# EAGLE schematic InkTime (EAGLE 9.7.0)

## Sheet 1 of 2
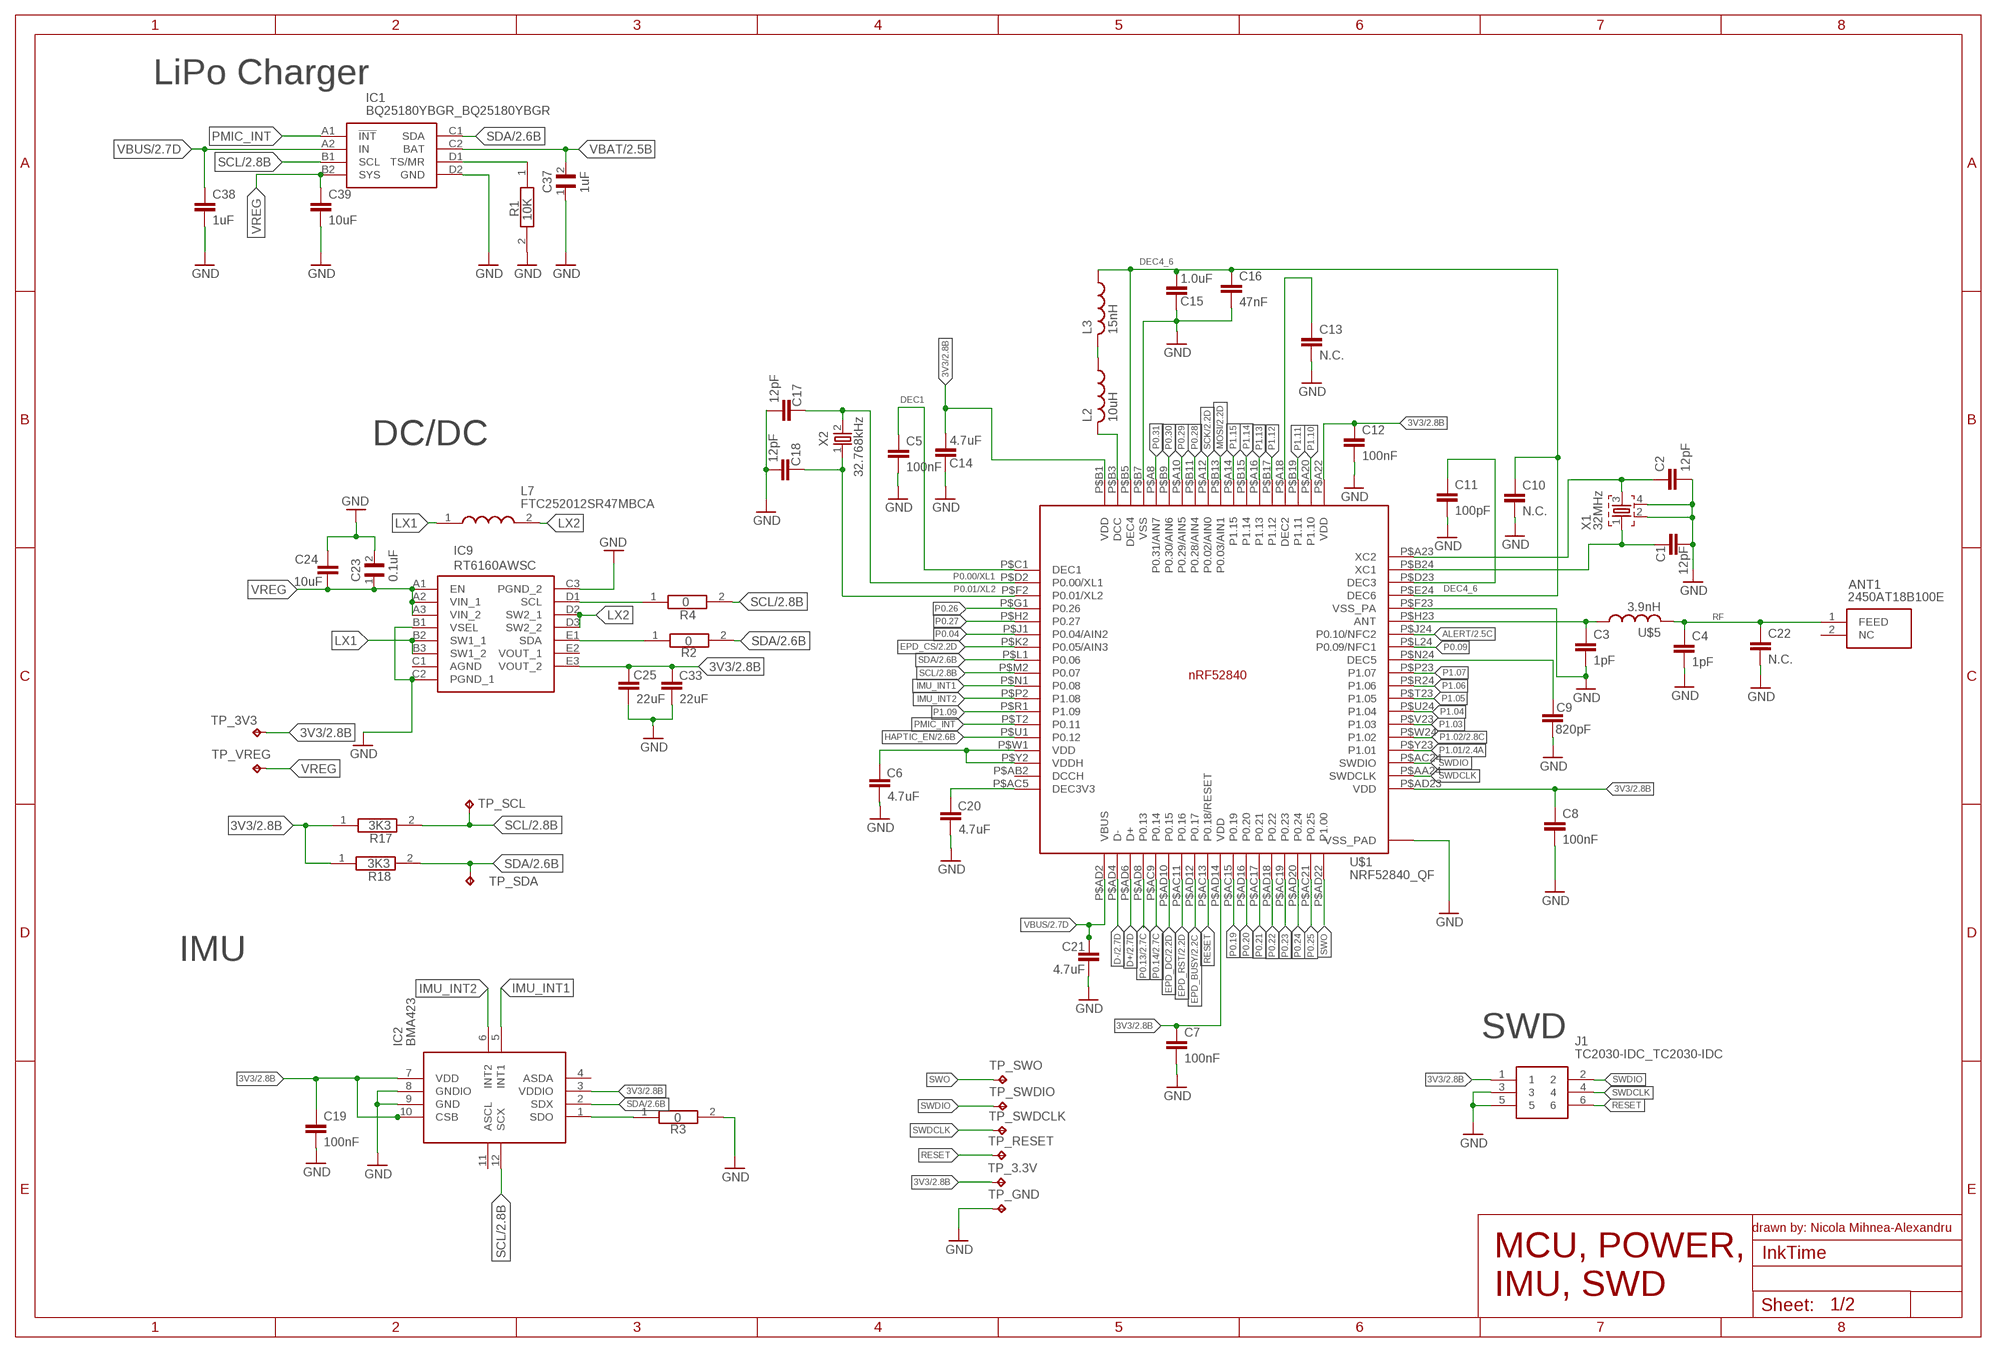
[diagram p0: schematic, sheet 1]

### Parts
ANT1  2450AT18B100E  2450AT18B100E_2450AT18B100E  [2450AT18B100E_ANTC3216X140N]
C1  12pF  NORDIC_NRF_3_CAPACITOR_0201_N  [NORDIC_NRF_3_RESC0201_N]
C2  12pF  NORDIC_NRF_3_CAPACITOR_0201_N  [NORDIC_NRF_3_RESC0201_N]
C3  1pF  NORDIC_NRF_3_CAPACITOR_0201_N  [NORDIC_NRF_3_RESC0201_N]
C4  1pF  NORDIC_NRF_3_CAPACITOR_0201_N  [NORDIC_NRF_3_RESC0201_N]
C5  100nF  NORDIC_NRF_3_CAPACITOR_0201_N  [NORDIC_NRF_3_RESC0201_N]
C6  4.7uF  NORDIC_NRF_3_CAPACITOR_0402_N  [NORDIC_NRF_3_RESC0402_N]
C7  100nF  NORDIC_NRF_3_CAPACITOR_0201_N  [NORDIC_NRF_3_RESC0201_N]
C8  100nF  NORDIC_NRF_3_CAPACITOR_0201_N  [NORDIC_NRF_3_RESC0201_N]
C9  820pF  NORDIC_NRF_3_CAPACITOR_0201_N  [NORDIC_NRF_3_RESC0201_N]
C10  N.C.  NORDIC_NRF_3_CAPACITOR_0201_N  [NORDIC_NRF_3_RESC0201_N]
C11  100pF  NORDIC_NRF_3_CAPACITOR_0201_N  [NORDIC_NRF_3_RESC0201_N]
C12  100nF  NORDIC_NRF_3_CAPACITOR_0201_N  [NORDIC_NRF_3_RESC0201_N]
C13  N.C.  NORDIC_NRF_3_CAPACITOR_0201_N  [NORDIC_NRF_3_RESC0201_N]
C14  4.7uF  NORDIC_NRF_3_CAPACITOR_0402_N  [NORDIC_NRF_3_RESC0402_N]
C15  1.0uF  NORDIC_NRF_3_CAPACITOR_0402_N  [NORDIC_NRF_3_RESC0402_N]
C16  47nF  NORDIC_NRF_3_CAPACITOR_0201_N  [NORDIC_NRF_3_RESC0201_N]
C17  12pF  NORDIC_NRF_3_CAPACITOR_0201_N  [NORDIC_NRF_3_RESC0201_N]
C18  12pF  NORDIC_NRF_3_CAPACITOR_0201_N  [NORDIC_NRF_3_RESC0201_N]
C19  100nF  NORDIC_NRF_3_CAPACITOR_0201_N  [NORDIC_NRF_3_RESC0201_N]
C20  4.7uF  NORDIC_NRF_3_CAPACITOR_0402_N  [NORDIC_NRF_3_RESC0402_N]
C21  4.7uF  NORDIC_NRF_3_CAPACITOR_0402_N  [NORDIC_NRF_3_RESC0402_N]
C22  N.C.  NORDIC_NRF_3_CAPACITOR_0201_N  [NORDIC_NRF_3_RESC0201_N]
C23  0.1uF  GRM011R60J152KE01L_2_GRM011R60J152KE01LGRM  [GRM011R60J152KE01L_2_CAPC0201X13N]
C24  10uF  NORDIC_NRF_3_CAPACITOR_0402_N  [NORDIC_NRF_3_RESC0402_N]
C25  22uF  NORDIC_NRF_3_CAPACITOR_0402_N  [NORDIC_NRF_3_RESC0402_N]
C33  22uF  NORDIC_NRF_3_CAPACITOR_0402_N  [NORDIC_NRF_3_RESC0402_N]
C37  1uF  GRM011R60J152KE01L_2_GRM011R60J152KE01LGRM  [GRM011R60J152KE01L_2_CAPC0201X13N]
C38  1uF  NORDIC_NRF_3_CAPACITOR_0402_N  [NORDIC_NRF_3_RESC0402_N]
C39  10uF  NORDIC_NRF_3_CAPACITOR_0402_N  [NORDIC_NRF_3_RESC0402_N]
IC1  BQ25180YBGR_BQ25180YBGR  [BQ25180YBGR_BGA8C40P2X4_100X155X50]
IC2  BMA423  BMA423_BMA423  [BMA423_BMA423]
IC9  RT6160AWSC  RT6160AWSC_RT6160AWSC  [RT6160AWSC_BGA15C40P3X5_140X230X60]
J1  TC2030-IDC_TC2030-IDC  [TC2030-IDC_TC2030IDC]
L2  10uH  NORDIC_NRF_2_INDUCTOR_0201_N  [NORDIC_NRF_2_RESC0201_N]
L3  15nH  NORDIC_NRF_2_INDUCTOR_0201_N  [NORDIC_NRF_2_RESC0201_N]
L7  FTC252012SR47MBCA  MLP2016SR47MT0S1_FTC252012SR47MBCA  [MLP2016SR47MT0S1_INDC2016X100N]
R1  10K  CPF0201D7K68C1_CPF0201D7K68C1  [CPF0201D7K68C1_0201]
R2  0  CPF0201D7K68C1_CPF0201D7K68C1  [CPF0201D7K68C1_0201]
R3  0  CPF0201D7K68C1_CPF0201D7K68C1  [CPF0201D7K68C1_0201]
R4  0  CPF0201D7K68C1_CPF0201D7K68C1  [CPF0201D7K68C1_0201]
R17  3K3  CPF0201D7K68C1_CPF0201D7K68C1  [CPF0201D7K68C1_0201]
R18  3K3  CPF0201D7K68C1_CPF0201D7K68C1  [CPF0201D7K68C1_0201]
TP_3.3V  HECTOR_WATCH_1_TPTP20R  [HECTOR_WATCH_1_TP20R]
TP_3V3  HECTOR_WATCH_1_TPTP20R  [HECTOR_WATCH_1_TP20R]
TP_GND  HECTOR_WATCH_1_TPTP20R  [HECTOR_WATCH_1_TP20R]
TP_RESET  HECTOR_WATCH_1_TPTP20R  [HECTOR_WATCH_1_TP20R]
TP_SCL  HECTOR_WATCH_1_TPTP20R  [HECTOR_WATCH_1_TP20R]
TP_SDA  HECTOR_WATCH_1_TPTP20R  [HECTOR_WATCH_1_TP20R]
TP_SWDCLK  HECTOR_WATCH_1_TPTP20R  [HECTOR_WATCH_1_TP20R]
TP_SWDIO  HECTOR_WATCH_1_TPTP20R  [HECTOR_WATCH_1_TP20R]
TP_SWO  HECTOR_WATCH_1_TPTP20R  [HECTOR_WATCH_1_TP20R]
TP_VREG  HECTOR_WATCH_1_TPTP20R  [HECTOR_WATCH_1_TP20R]
U$1  NRF52840_QF  NORDIC_NRF_4_NRF52840_QF  [NORDIC_NRF_4_AQFN50P700X700X85_HS-74N]
U$5  3.9nH  NORDIC_NRF_2_INDUCTOR_0201_N  [NORDIC_NRF_2_RESC0201_N]
X1  32MHz  NORDIC_NRF_XTAL_32MHZ  [NORDIC_NRF_BT-XTAL_2016_N]
X2  32.768kHz  NORDIC_NRF_1_XTAL_32KHZ  [NORDIC_NRF_1_XTAL_3215_N]

### Nets
3V3 [power]: C7.1 C8.1 C12.1 C14.2 C19.1 C25.1 C33.1 IC2.3(VDDIO) IC9.E3(VOUT_2) J1.1 R17.1 R18.1 TP_3.3V.TP TP_3V3.TP U$1.P$A22(VDD) U$1.P$AD14(VDD) U$1.P$AD23(VDD) U$1.P$B1(VDD) ; also sheet 2
ALERT: U$1.P$J24(P0.10/NFC2) ; also sheet 2
D+: U$1.P$AD6(D+) ; also sheet 2
D-: U$1.P$AD4(D-) ; also sheet 2
DEC1: C5.1 U$1.P$C1(DEC1)
DEC4_6: C10.1 C15.2 C16.1 L3.1 U$1.P$B5(DEC4) U$1.P$E24(DEC6)
EPD_BUSY: U$1.P$AD12(P0.17) ; also sheet 2
EPD_CS: U$1.P$K2(P0.05/AIN3) ; also sheet 2
EPD_DC: U$1.P$AD10(P0.15) ; also sheet 2
EPD_RST: U$1.P$AC11(P0.16) ; also sheet 2
GND [power]: C1.2 C2.2 C3.2 C4.2 C5.2 C6.2 C7.2 C8.2 C9.2 C10.2 C11.2 C12.2 C13.2 C14.1 C15.1 C16.2 C17.2 C18.2 C19.2 C20.2 C21.2 C22.2 C23.2 C24.1 C25.2 C33.2 C37.1 C38.2 C39.2 IC1.D2(GND) IC2.8(GNDIO) IC2.9(GND) IC9.B1(VSEL) IC9.C2(PGND_1) IC9.C3(PGND_2) J1.3 J1.5 R1.2 R3.2 TP_GND.TP U$1.P$74(VSS_PAD) U$1.P$75(VSS_PAD) U$1.P$76(VSS_PAD) U$1.P$77(VSS_PAD) U$1.P$78(VSS_PAD) U$1.P$79(VSS_PAD) U$1.P$80(VSS_PAD) U$1.P$81(VSS_PAD) U$1.P$82(VSS_PAD) U$1.P$83(VSS_PAD) U$1.P$84(VSS_PAD) U$1.P$85(VSS_PAD) U$1.P$86(VSS_PAD) U$1.P$87(VSS_PAD) U$1.P$88(VSS_PAD) U$1.P$89(VSS_PAD) U$1.P$90(VSS_PAD) U$1.P$B7(VSS) U$1.P$F23(VSS_PA) X1.2 X1.4 ; also sheet 2
HAPTIC_EN: U$1.P$U1(P0.12) ; also sheet 2
IMU_INT1: IC2.5(INT1) U$1.P$N1(P0.08)
IMU_INT2: IC2.6(INT2) U$1.P$P2(P1.08)
LX1: IC9.B2(SW1_1) IC9.B3(SW1_2) L7.1
LX2: IC9.D2(SW2_1) IC9.D3(SW2_2) L7.2
MOSI: U$1.P$B13(P0.03/AIN1) ; also sheet 2
N$1: C20.1 U$1.P$AC5(DEC3V3)
N$2: IC9.D1(SCL) R4.1
N$4: IC9.E1(SDA) R2.1
N$5: IC1.D1(TS/MR) R1.1
N$6: U$1.P$Y2(VDDH)
N$7: C6.1 U$1.P$W1(VDD)
N$8: IC2.7(VDD) IC2.10(CSB)
N$9: L2.2 U$1.P$B3(DCC)
N$10: L2.1 L3.2
N$11: IC2.1(SDO) R3.1
N$12: C11.1 U$1.P$D23(DEC3)
N$13: C2.1 U$1.P$A23(XC2) X1.3
N$14: C13.1 U$1.P$A18(DEC2)
N$16: C1.1 U$1.P$B24(XC1) X1.1
N$17: C3.1 U$1.P$H23(ANT) U$5.1
N$19: C9.1 U$1.P$N24(DEC5)
P0.00/XL1: C17.1 U$1.P$D2(P0.00/XL1) X2.2
P0.01/XL2: C18.1 U$1.P$F2(P0.01/XL2) X2.1
P0.04: U$1.P$J1(P0.04/AIN2)
P0.09: U$1.P$L24(P0.09/NFC1)
P0.13: U$1.P$AD8(P0.13) ; also sheet 2
P0.14: U$1.P$AC9(P0.14) ; also sheet 2
P0.19: U$1.P$AC15(P0.19)
P0.20: U$1.P$AD16(P0.20)
P0.21: U$1.P$AC17(P0.21)
P0.22: U$1.P$AD18(P0.22)
P0.23: U$1.P$AC19(P0.23)
P0.24: U$1.P$AD20(P0.24)
P0.25: U$1.P$AC21(P0.25)
P0.26: U$1.P$G1(P0.26)
P0.27: U$1.P$H2(P0.27)
P0.28: U$1.P$B11(P0.28/AIN4)
P0.29: U$1.P$A10(P0.29/AIN5)
P0.30: U$1.P$B9(P0.30/AIN6)
P0.31: U$1.P$A8(P0.31/AIN7)
P1.01: U$1.P$Y23(P1.01) ; also sheet 2
P1.02: U$1.P$W24(P1.02) ; also sheet 2
P1.03: U$1.P$V23(P1.03)
P1.04: U$1.P$U24(P1.04)
P1.05: U$1.P$T23(P1.05)
P1.06: U$1.P$R24(P1.06)
P1.07: U$1.P$P23(P1.07)
P1.09: U$1.P$R1(P1.09)
P1.10: U$1.P$A20(P1.10)
P1.11: U$1.P$B19(P1.11)
P1.12: U$1.P$B17(P1.12)
P1.13: U$1.P$A16(P1.13)
P1.14: U$1.P$B15(P1.14)
P1.15: U$1.P$A14(P1.15)
PMIC_INT: IC1.A1(!INT) U$1.P$T2(P0.11)
RESET: J1.6 TP_RESET.TP U$1.P$AC13(P0.18/RESET)
RF: ANT1.1(FEED) C4.1 C22.1 U$5.2
SCK: U$1.P$A12(P0.02/AIN0) ; also sheet 2
SCL: IC1.B1(SCL) IC2.12(SCX) R4.2 R17.2 TP_SCL.TP U$1.P$M2(P0.07) ; also sheet 2
SDA: IC1.C1(SDA) IC2.2(SDX) R2.2 R18.2 TP_SDA.TP U$1.P$L1(P0.06) ; also sheet 2
SWDCLK: J1.4 TP_SWDCLK.TP U$1.P$AA24(SWDCLK)
SWDIO: J1.2 TP_SWDIO.TP U$1.P$AC24(SWDIO)
SWO: TP_SWO.TP U$1.P$AD22(P1.00)
VBAT [power]: C37.2 IC1.C2(BAT) ; also sheet 2
VBUS [power]: C21.1 C38.1 IC1.A2(IN) U$1.P$AD2(VBUS) ; also sheet 2
VREG [power]: C23.1 C24.2 C39.1 IC1.B2(SYS) IC9.A1(EN) IC9.A2(VIN_1) IC9.A3(VIN_2) TP_VREG.TP
Unconnected: ANT1.2(NC) IC2.4(ASDA) IC2.11(ASCL) IC9.C1(AGND) IC9.E2(VOUT_1) U$1.P$AB2(DCCH)

### Notes on the sheet
- LiPo Charger
- DC/DC
- IMU
- SWD
- drawn by: Nicola Mihnea-Alexandru
- MCU, POWER,
  IMU, SWD

## Sheet 2 of 2
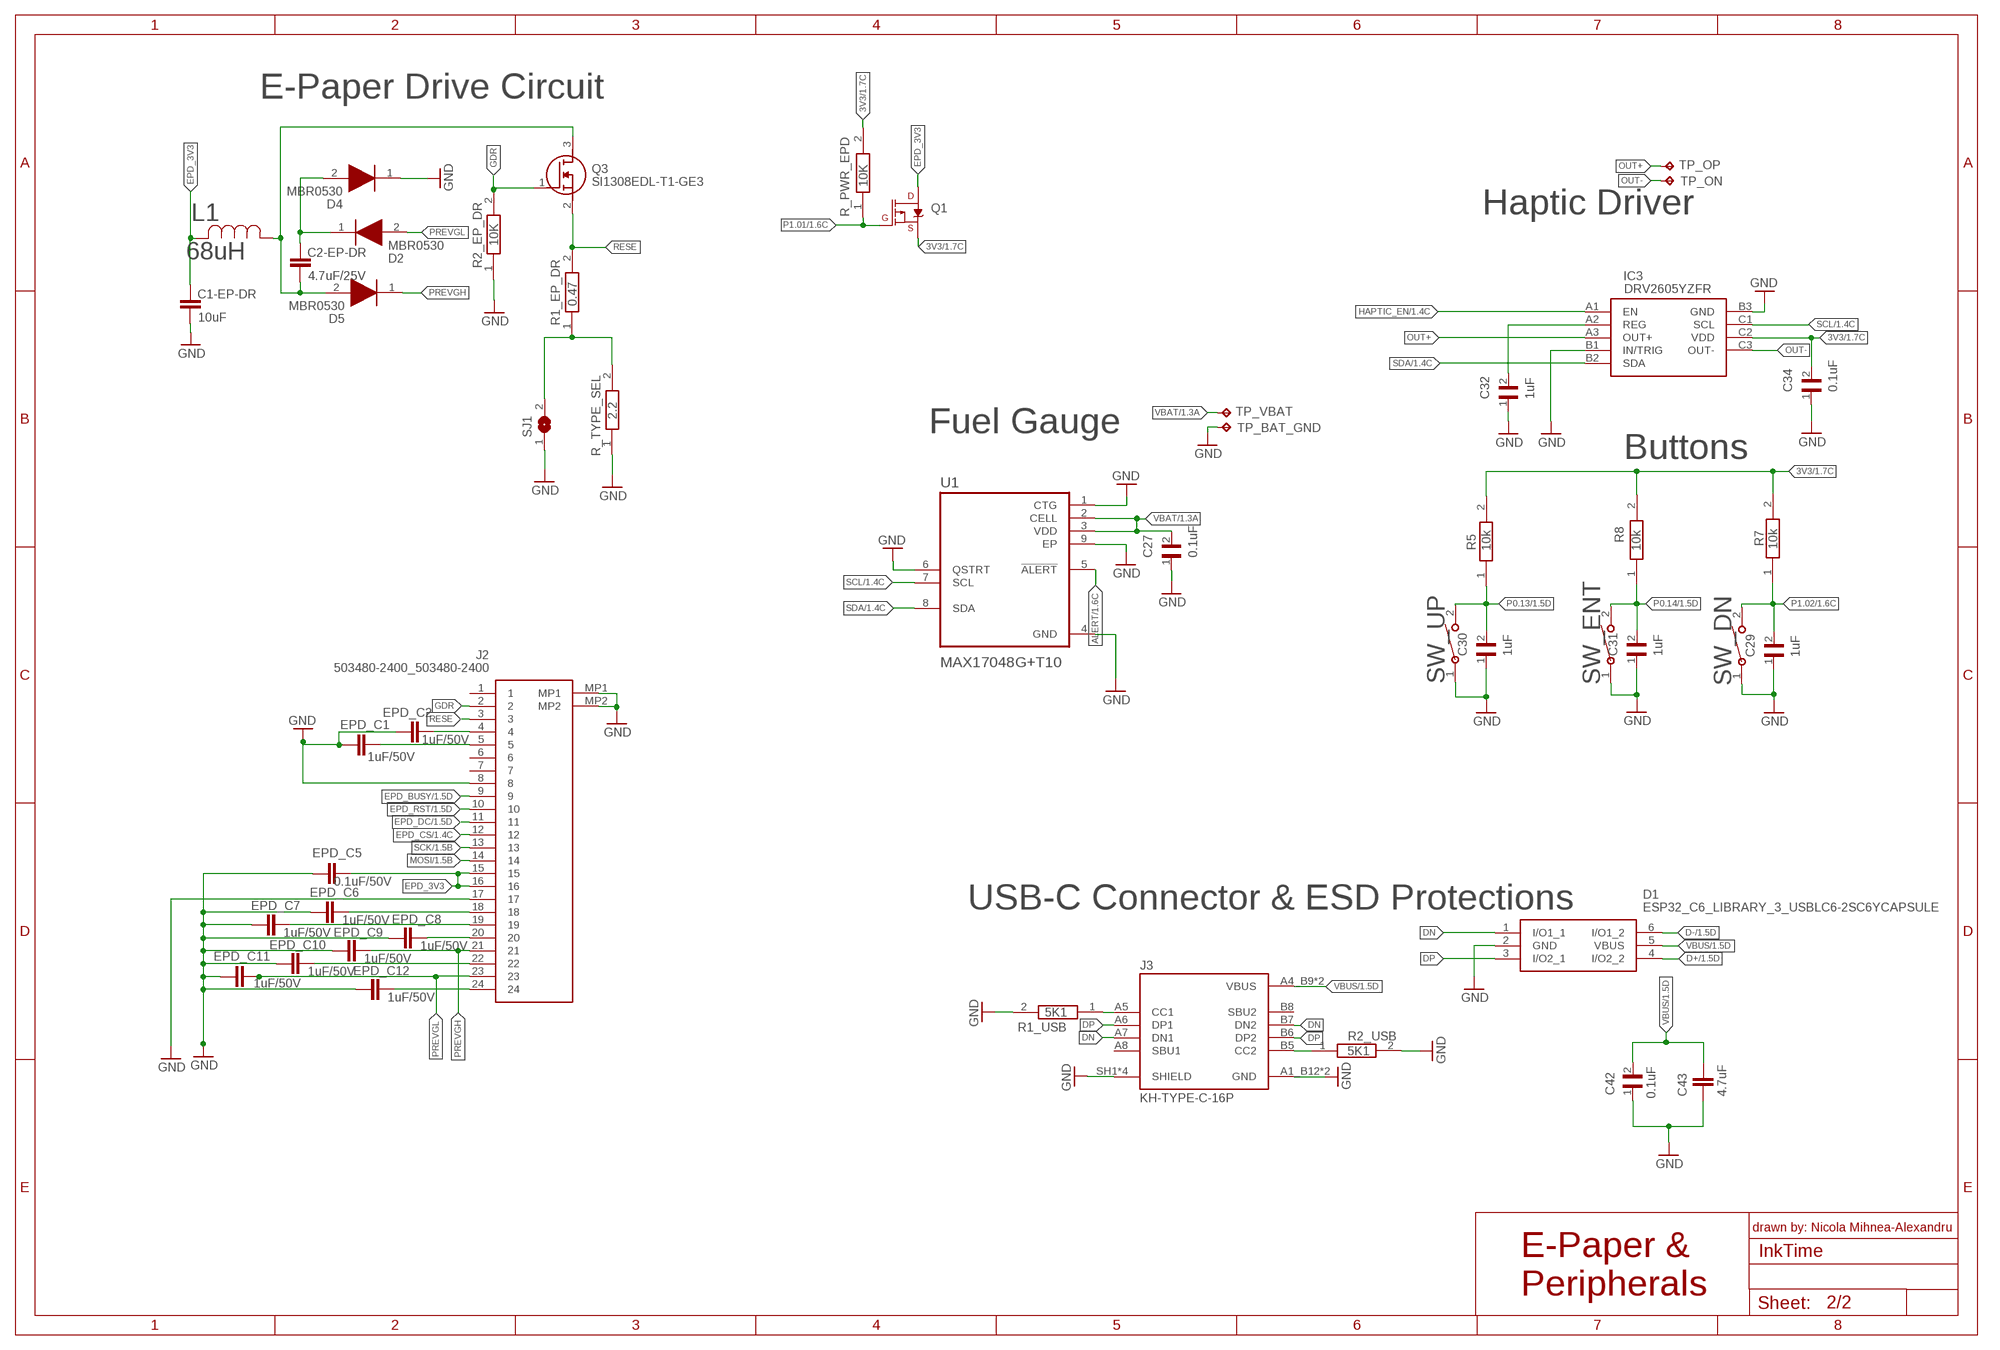
[diagram p1: schematic, sheet 2]

### Parts
C1-EP-DR  10uF  NORDIC_NRF_3_CAPACITOR_0402_N  [NORDIC_NRF_3_RESC0402_N]
C2-EP-DR  4.7uF/25V  NORDIC_NRF_3_CAPACITOR_0402_N  [NORDIC_NRF_3_RESC0402_N]
C27  0.1uF  GRM011R60J152KE01L_2_GRM011R60J152KE01LGRM  [GRM011R60J152KE01L_2_CAPC0201X13N]
C29  1uF  GRM011R60J152KE01L_2_GRM011R60J152KE01LGRM  [GRM011R60J152KE01L_2_CAPC0201X13N]
C30  1uF  GRM011R60J152KE01L_2_GRM011R60J152KE01LGRM  [GRM011R60J152KE01L_2_CAPC0201X13N]
C31  1uF  GRM011R60J152KE01L_2_GRM011R60J152KE01LGRM  [GRM011R60J152KE01L_2_CAPC0201X13N]
C32  1uF  GRM011R60J152KE01L_2_GRM011R60J152KE01LGRM  [GRM011R60J152KE01L_2_CAPC0201X13N]
C34  0.1uF  GRM011R60J152KE01L_2_GRM011R60J152KE01LGRM  [GRM011R60J152KE01L_2_CAPC0201X13N]
C42  0.1uF  GRM011R60J152KE01L_2_GRM011R60J152KE01L  [GRM011R60J152KE01L_2_CAPC0201X13N]
C43  4.7uF  NORDIC_NRF_3_CAPACITOR_0402_N  [NORDIC_NRF_3_RESC0402_N]
D1  ESP32_C6_LIBRARY_3_USBLC6-2SC6YCAPSULE  [ESP32_C6_LIBRARY_3_SOT95P280X145-6N]
D2  MBR0530  ESP32_C6_LIBRARY_5_MBR0530MBRR  [ESP32_C6_LIBRARY_5_SOD3716X135N]
D4  MBR0530  ESP32_C6_LIBRARY_5_MBR0530MBRR  [ESP32_C6_LIBRARY_5_SOD3716X135N]
D5  MBR0530  ESP32_C6_LIBRARY_5_MBR0530MBRR  [ESP32_C6_LIBRARY_5_SOD3716X135N]
EPD_C1  1uF/50V  NORDIC_NRF_3_CAPACITOR_0402_N  [NORDIC_NRF_3_RESC0402_N]
EPD_C2  1uF/50V  NORDIC_NRF_3_CAPACITOR_0402_N  [NORDIC_NRF_3_RESC0402_N]
EPD_C5  0.1uF/50V  NORDIC_NRF_3_CAPACITOR_0402_N  [NORDIC_NRF_3_RESC0402_N]
EPD_C6  1uF/50V  NORDIC_NRF_3_CAPACITOR_0402_N  [NORDIC_NRF_3_RESC0402_N]
EPD_C7  1uF/50V  NORDIC_NRF_3_CAPACITOR_0402_N  [NORDIC_NRF_3_RESC0402_N]
EPD_C8  1uF/50V  NORDIC_NRF_3_CAPACITOR_0402_N  [NORDIC_NRF_3_RESC0402_N]
EPD_C9  1uF/50V  NORDIC_NRF_3_CAPACITOR_0402_N  [NORDIC_NRF_3_RESC0402_N]
EPD_C10  1uF/50V  NORDIC_NRF_3_CAPACITOR_0402_N  [NORDIC_NRF_3_RESC0402_N]
EPD_C11  1uF/50V  NORDIC_NRF_3_CAPACITOR_0402_N  [NORDIC_NRF_3_RESC0402_N]
EPD_C12  1uF/50V  NORDIC_NRF_3_CAPACITOR_0402_N  [NORDIC_NRF_3_RESC0402_N]
IC3  DRV2605YZFR  DRV2605YZFR_DRV2605YZFR  [DRV2605YZFR_BGA9C50P3X3_144X144X62]
J2  503480-2400_503480-2400  [503480-2400_5034802400]
J3  KH-TYPE-C-16P  KH-TYPE-C-16P_KH-TYPE-C-16PKH  [KH-TYPE-C-16P_KINGHELM_KH-TYPE-C-16P]
L1  68uH  ESP32_C6_LIBRARY_2_744043680IND_4828-WE-TPC_WRE  [ESP32_C6_LIBRARY_2_IND_4828-WE-TPC_WRE]
Q1  ESP32_C6_LIBRARY_4_ESP32_WROVER_SPARKFUN-DISCRETESEMI_MOSFET_PCH  [ESP32_C6_LIBRARY_4_ESP32_C6_LIBRARY_4_ESP32_C6_LIBRARY_4_ESP32_C6_LIBRARY_4_ESP32_WROVER_SPARKFUN-DISCRETESEMI_SOT23-3]
Q3  SI1308EDL-T1-GE3  ESP32_C6_LIBRARY_6_SI1308EDL-T1-GE3SIU  [ESP32_C6_LIBRARY_6_SOT65P210X110-3N]
R1_EP_DR  0.47  CPF0201D7K68C1_CPF0201D7K68C1  [CPF0201D7K68C1_0201]
R1_USB  5K1  CPF0201D7K68C1_CPF0201D7K68C1  [CPF0201D7K68C1_0201]
R2_EP_DR  10K  CPF0201D7K68C1_CPF0201D7K68C1  [CPF0201D7K68C1_0201]
R2_USB  5K1  CPF0201D7K68C1_CPF0201D7K68C1  [CPF0201D7K68C1_0201]
R5  10k  CPF0201D7K68C1_CPF0201D7K68C1  [CPF0201D7K68C1_0201]
R7  10k  CPF0201D7K68C1_CPF0201D7K68C1  [CPF0201D7K68C1_0201]
R8  10k  CPF0201D7K68C1_CPF0201D7K68C1  [CPF0201D7K68C1_0201]
R_PWR_EPD  10K  CPF0201D7K68C1_CPF0201D7K68C1  [CPF0201D7K68C1_0201]
R_TYPE_SEL  2.2  CPF0201D7K68C1_CPF0201D7K68C1  [CPF0201D7K68C1_0201]
SJ1  ESP32_C6_LIBRARY_7_JUMPER_SJ  [ESP32_C6_LIBRARY_7_JUMPER_SJ]
SW_DN  2025-10-22_07-23-44_LIBRARY_EVP-AKE31A  [2025-10-22_07-23-44_LIBRARY_SW_EVP-AKE31A_PAN]
SW_ENT  2025-10-22_07-23-44_LIBRARY_EVP-AKE31A  [2025-10-22_07-23-44_LIBRARY_SW_EVP-AKE31A_PAN]
SW_UP  2025-10-22_07-23-44_LIBRARY_EVP-AKE31A  [2025-10-22_07-23-44_LIBRARY_SW_EVP-AKE31A_PAN]
TP_BAT_GND  HECTOR_WATCH_1_TPTP20R  [HECTOR_WATCH_1_TP20R]
TP_ON  HECTOR_WATCH_1_TPTP20R  [HECTOR_WATCH_1_TP20R]
TP_OP  HECTOR_WATCH_1_TPTP20R  [HECTOR_WATCH_1_TP20R]
TP_VBAT  HECTOR_WATCH_1_TPTP20R  [HECTOR_WATCH_1_TP20R]
U1  MAX17048G+T10  ESP32_C6_LIBRARY_MAX17048G+T10  [ESP32_C6_LIBRARY_SON50P200X200X80-9N]

### Nets
3V3 [power]: C34.2 IC3.C2(VDD) Q1.2(S) R5.2 R7.2 R8.2 R_PWR_EPD.2 ; also sheet 1
ALERT: U1.5(!ALERT) ; also sheet 1
D+: D1.4(I/O2_2) ; also sheet 1
D-: D1.6(I/O1_2) ; also sheet 1
DN: D1.1(I/O1_1) J3.A7(DN1) J3.B7(DN2)
DP: D1.3(I/O2_1) J3.A6(DP1) J3.B6(DP2)
EPD_3V3 [power]: C1-EP-DR.1 EPD_C5.2 J2.15 J2.16 L1.2 Q1.3(D)
EPD_BUSY: J2.9 ; also sheet 1
EPD_CS: J2.12 ; also sheet 1
EPD_DC: J2.11 ; also sheet 1
EPD_RST: J2.10 ; also sheet 1
GDR: J2.2 Q3.1(G) R2_EP_DR.2
GND [power]: C1-EP-DR.2 C27.1 C29.1 C30.1 C31.1 C32.1 C34.1 C42.1 C43.1 D1.2(GND) D4.1(K) EPD_C1.1 EPD_C2.1 EPD_C5.1 EPD_C6.1 EPD_C7.1 EPD_C8.1 EPD_C9.1 EPD_C10.1 EPD_C11.1 EPD_C12.1 IC3.B1(IN/TRIG) IC3.B3(GND) J2.8 J2.17 J2.MP1 J2.MP2 J3.A1_B12(GND) J3.A12_B1(GND) J3.SH1(SHIELD) J3.SH2(SHIELD) J3.SH3(SHIELD) J3.SH4(SHIELD) R1_USB.2 R2_EP_DR.1 R2_USB.2 R_TYPE_SEL.1 SJ1.1 SW_DN.1 SW_ENT.1 SW_UP.1 TP_BAT_GND.TP U1.1(CTG) U1.4(GND) U1.6(QSTRT) U1.9(EP) ; also sheet 1
HAPTIC_EN: IC3.A1(EN) ; also sheet 1
MOSI: J2.14 ; also sheet 1
N$3: C32.2 IC3.A2(REG)
N$18: C2-EP-DR.2 D5.2(A) L1.1 Q3.3(D)
N$20: C2-EP-DR.1 D2.1(K) D4.2(A)
N$22: EPD_C2.2 J2.4
N$23: EPD_C1.2 J2.5
N$25: R1_EP_DR.1 R_TYPE_SEL.2 SJ1.2
N$28: J3.A5(CC1) R1_USB.1
N$29: J3.B5(CC2) R2_USB.1
N$31: EPD_C10.2 J2.22
N$32: EPD_C6.2 J2.18
N$33: EPD_C7.2 J2.19
N$34: EPD_C8.2 J2.20
N$38: EPD_C12.2 J2.24
OUT+: IC3.A3(OUT+) TP_OP.TP
OUT-: IC3.C3(OUT-) TP_ON.TP
P0.13: C30.2 R5.1 SW_UP.2 ; also sheet 1
P0.14: C31.2 R8.1 SW_ENT.2 ; also sheet 1
P1.01: Q1.1(G) R_PWR_EPD.1 ; also sheet 1
P1.02: C29.2 R7.1 SW_DN.2 ; also sheet 1
PREVGH: D5.1(K) EPD_C9.2 J2.21
PREVGL: D2.2(A) EPD_C11.2 J2.23
RESE: J2.3 Q3.2(S) R1_EP_DR.2
SCK: J2.13 ; also sheet 1
SCL: IC3.C1(SCL) U1.7(SCL) ; also sheet 1
SDA: IC3.B2(SDA) U1.8(SDA) ; also sheet 1
VBAT [power]: C27.2 TP_VBAT.TP U1.2(CELL) U1.3(VDD) ; also sheet 1
VBUS [power]: C42.2 C43.2 D1.5(VBUS) J3.A4_B9(VBUS) J3.A9_B4(VBUS) ; also sheet 1
Unconnected: J2.1 J2.6 J2.7 J3.A8(SBU1) J3.B8(SBU2)

### Notes on the sheet
- E-Paper Drive Circuit
- Haptic Driver
- Fuel Gauge
- Buttons
- USB-C Connector & ESD Protections
- drawn by: Nicola Mihnea-Alexandru
- E-Paper &
  Peripherals

## Library data of the parts
ANT1 = InkTime_v5:2450AT18B100E_2450AT18B100E: Antennas 2.45GHz ANTENNA Source: Datasheet <https://www.johansontechnology.com/datasheets/2450AT18B100/2450AT18B100.pdf>; ARROW_PART_NUMBER: 2450AT18B100E; ARROW_PRICE-STOCK: https://www.arrow.com/en/products/2450at18b100e/johanson-dielectrics?utm_currency=USD&region=nac; DESCRIPTION: Antennas 2.45GHz ANTENNA; HEIGHT: 1.4mm; MANUFACTURER_NAME: JOHANSON TECHNOLOGY; MANUFACTURER_PART_NUMBER: 2450AT18B100E; MOUSER_PART_NUMBER: 609-2450AT18B100E; MOUSER_PRICE-STOCK: https://www.mouser.co.uk/ProductDetail/Johanson-Technology/2450AT18B100E?qs=yCnrNFeXz%252Bh5MFsFIXGZGA%3D%3D
C1 C1-EP-DR C2 C2-EP-DR C3-C22 C24 C25 C33 C38 C39 C43 EPD_C1 EPD_C2 EPD_C5-EPD_C12 = InkTime_v5:NORDIC_NRF_3_CAPACITOR: Generic chip capacitor
C23 C27 C29-C32 C34 C37 = InkTime_v5:GRM011R60J152KE01L_2_GRM011R60J152KE01L: Check availability <https://pricing.snapeda.com/parts/GRM011R60J152KE01L/Murata/view-part?ref=eda>
C42 = InkTime_v5:GRM011R60J152KE01L_2_GRM011R60J152KE01L: Check availability <https://pricing.snapeda.com/parts/GRM011R60J152KE01L/Murata/view-part?ref=eda>; AVAILABILITY: In Stock; CHECK_PRICES: https://www.snapeda.com/parts/GRM011R60J152KE01L/Murata/view-part/?ref=eda; DESCRIPTION: SMD Capacitor X5R(EIA) with Capacitance: 1500pF Tol. 10%. Rated Voltage: 6.3Vdc; MF: Murata; MP: GRM011R60J152KE01L; PACKAGE: 0201 Murata; PRICE: None; SNAPEDA_LINK: https://www.snapeda.com/parts/GRM011R60J152KE01L/Murata/view-part/?ref=snap
D1 = InkTime_v5:ESP32_C6_LIBRARY_3_USBLC6-2SC6Y: Low Cap. ESD Protection Auto SOT-23-6 STMicroelectronics USBLC6-2SC6Y, Dual Uni-Directional TVS Diode Array, 6-Pin SOT-23 Source: Datasheet <https://componentsearchengine.com/Datasheets/1/USBLC6-2SC6Y.pdf> Check availability <https://pricing.snapeda.com/parts/USBLC6-2SC6Y/STMicroelectronics/view-part?ref=eda>
D2 D4 D5 = InkTime_v5:ESP32_C6_LIBRARY_5_MBR0530: ON SEMICONDUCTOR - MBR0530 - DIODE, SCHOTTKY, 0.5A, 30V, SOD-123 Source: Datasheet <http://www.onsemi.com/pub/Collateral/MBR0530T1-D.PDF> Check availability <https://pricing.snapeda.com/parts/MBR0530/ON%20Semiconductor/view-part?ref=eda>
IC1 = InkTime_v5:BQ25180YBGR_BQ25180YBGR: Charger IC Lithium Ion/Polymer, Lithium Iron Phosphate 8-DSBGA (1.6x1.1) Source: Datasheet <https://www.ti.com/lit/ds/symlink/bq25180.pdf?ts=1650264094470&ref_url=https%3A%2F%2Fwww.ti.com%2Fproduct%2FBQ25180>; ARROW_PART_NUMBER: BQ25180YBGR; ARROW_PRICE-STOCK: https://www.arrow.com/en/products/bq25180ybgr/texas-instruments?utm_currency=USD&region=nac; DESCRIPTION: Charger IC Lithium Ion/Polymer, Lithium Iron Phosphate 8-DSBGA (1.6x1.1); HEIGHT: 0.5mm; MANUFACTURER_NAME: Texas Instruments; MANUFACTURER_PART_NUMBER: BQ25180YBGR; MOUSER_PART_NUMBER: 595-BQ25180YBGR; MOUSER_PRICE-STOCK: https://www.mouser.co.uk/ProductDetail/Texas-Instruments/BQ25180YBGR?qs=doiCPypUmgEWjAK%252BJAX6Tw%3D%3D
IC2 = InkTime_v5:BMA423_BMA423: Accelerometers Triaxial low-g 12bit Acceleration Sensor Source: Datasheet <https://www.mouser.com/datasheet/2/783/BST-BMA423-DS000-1509600.pdf>; ARROW_PART_NUMBER: BMA423; ARROW_PRICE-STOCK: https://www.arrow.com/en/products/bma423/bosch; DESCRIPTION: Accelerometers Triaxial low-g 12bit Acceleration Sensor; HEIGHT: 1mm; MANUFACTURER_NAME: BOSCH; MANUFACTURER_PART_NUMBER: BMA423; MOUSER_PART_NUMBER: 262-BMA423; MOUSER_PRICE-STOCK: https://www.mouser.co.uk/ProductDetail/Bosch-Sensortec/BMA423?qs=HXFqYaX1Q2xC%252BSgeGoX3mg%3D%3D
IC3 = InkTime_v5:DRV2605YZFR_DRV2605YZFR: Haptic Driver for ERM/LRA with Built-In Library and Smart Loop Architecture Source: Datasheet <http://www.ti.com/lit/gpn/drv2605>; ARROW_PART_NUMBER: DRV2605YZFR; ARROW_PRICE-STOCK: https://www.arrow.com/en/products/drv2605yzfr/texas-instruments?region=nac; DESCRIPTION: Haptic Driver for ERM/LRA with Built-In Library and Smart Loop Architecture; HEIGHT: 0.625mm; MANUFACTURER_NAME: Texas Instruments; MANUFACTURER_PART_NUMBER: DRV2605YZFR
IC9 = InkTime_v5:RT6160AWSC_RT6160AWSC: Buck-Boost Regulator Positive Output Step-Up/Step-Down I2C DC-DC Controller IC 15-WL-CSP (BSC) (1.4x2.3) Source: Datasheet <https://www.richtek.com/SaveDownload.aspx?specid=RT6160A>; DESCRIPTION: Buck-Boost Regulator Positive Output Step-Up/Step-Down I2C DC-DC Controller IC 15-WL-CSP (BSC) (1.4x2.3); HEIGHT: 0.6mm; MANUFACTURER_NAME: RICHTEK; MANUFACTURER_PART_NUMBER: RT6160AWSC; MOUSER_PART_NUMBER: 835-RT6160AWSC; MOUSER_PRICE-STOCK: https://www.mouser.co.uk/ProductDetail/Richtek/RT6160AWSC?qs=amGC7iS6iy%2FLd9PSoixZXQ%3D%3D
J1 = InkTime_v5:TC2030-IDC_TC2030-IDC: CABLE ADAPTER 6 POS Source: Datasheet <https://datasheet.datasheetarchive.com/originals/distributors/Datasheets_SAMA/62bc384e093448baaaa63dbd0b9d8707.pdf>; DESCRIPTION: CABLE ADAPTER 6 POS; HEIGHT: 19mm; MANUFACTURER_NAME: Tag Connect; MANUFACTURER_PART_NUMBER: TC2030-IDC
J2 = InkTime_v5:503480-2400_503480-2400: FFC & FPC Connectors 0.5mm FPC RA SMT Dual Contact 24Ckt Source: Datasheet <https://componentsearchengine.com/Datasheets/1/503480-2400.pdf>; DESCRIPTION: FFC & FPC Connectors 0.5mm FPC RA SMT Dual Contact 24Ckt; HEIGHT: 1.87mm; MANUFACTURER_NAME: Molex; MANUFACTURER_PART_NUMBER: 503480-2400; MOUSER_PART_NUMBER: 538-503480-2400; MOUSER_PRICE-STOCK: https://www.mouser.co.uk/ProductDetail/Molex/503480-2400?qs=OAhjpuo3Vu7efIoxFh9AOw%3D%3D
J3 = InkTime_v5:KH-TYPE-C-16P_KH-TYPE-C-16P: Check availability <https://pricing.snapeda.com/parts/KH-TYPE-C-16P/kinghelm/view-part?ref=eda>
L1 = InkTime_v5:ESP32_C6_LIBRARY_2_744043680; COPYRIGHT: Copyright (C) 2024 Ultra Librarian. All rights reserved.; MANUFACTURER_PART_NUMBER: 744043680; MFR_NAME: Wurth Electronics
L2 L3 U$5 = InkTime_v5:NORDIC_NRF_2_INDUCTOR: Generic chip inductor
L7 = InkTime_v5:MLP2016SR47MT0S1_FTC252012SR47MBCA: SMD / SMT Inductors (Coils), L=0.47?H, L x W x T : Source: Datasheet <https://product.tdk.com/system/files/dam/doc/product/inductor/inductor/smd/catalog/inductor_commercial_power_mlp2016_en.pdf>; DESCRIPTION: SMD / SMT Inductors (Coils), L=0.47?H, L x W x T :; HEIGHT: 1mm; JLCPCB: https://jlcpcb.com/partdetail/6763488-FTC252012SR47MBCA/C5832368; MANUFACTURER_NAME: TDK; MANUFACTURER_PART_NUMBER: FTC252012SR47MBCA
Q1 = InkTime_v5:ESP32_C6_LIBRARY_4_ESP32_WROVER_SPARKFUN-DISCRETESEMI_MOSFET_PCH: P-channel MOSFETs Voltage controlled devices that allow control of high current outputs. SparkFun Products: SparkFun ESP32 Thing <https://www.sparkfun.com/products/13907> SparkFun ESP8266 Thing <https://www.sparkfun.com/products/13231> SparkFun Pi Servo HAT V2 <https://www.sparkfun.com/products/15316> DMG2305UX-7 (20V/4.2A/SOT23-3)
Q3 = InkTime_v5:ESP32_C6_LIBRARY_6_SI1308EDL-T1-GE3: MOSFET N-Ch 30V 1.5A TrenchFET SC70 Vishay Si1308EDL-T1-GE3 N-channel MOSFET Transistor, 1.5 A, 30 V, 3-Pin SC-70 Source: Datasheet <https://componentsearchengine.com/Datasheets/1/SI1308EDL-T1-GE3.pdf> Check availability <https://pricing.snapeda.com/parts/SI1308EDL-T1-GE3/Vishay%20Siliconix/view-part?ref=eda>
R1 R1_EP_DR R1_USB R2 R2_EP_DR R2_USB R3-R5 R7 R8 R17 R18 R_PWR_EPD R_TYPE_SEL = InkTime_v5:CPF0201D7K68C1_CPF0201D7K68C1: 7.68k 0201 Thin Film Surface Mount Fixed Resistor +/-0.5% 0.031W CPF0201D7K68C1 Source: Datasheet <http://www.te.com/commerce/DocumentDelivery/DDEController?Action=showdoc&DocId=Data Sheet1773200-1ApdfEnglishENG_DS_1773200-1_A.pdf4-2176215-6>
SJ1 = InkTime_v5:ESP32_C6_LIBRARY_7_JUMPER_SJ: SMD solder JUMPER
SW_DN SW_ENT SW_UP = InkTime_v5:2025-10-22_07-23-44_LIBRARY_EVP-AKE31A
TP_3.3V TP_3V3 TP_BAT_GND TP_GND TP_ON TP_OP TP_RESET TP_SCL TP_SDA TP_SWDCLK TP_SWDIO TP_SWO TP_VBAT TP_VREG = InkTime_v5:HECTOR_WATCH_1_TP: Test pad
U1 = InkTime_v5:ESP32_C6_LIBRARY_MAX17048G+T10: Check availability <https://pricing.snapeda.com/parts/MAX17048G%2BT10/Analog%20Devices/view-part?ref=eda>; AVAILABILITY: In Stock; CHECK_PRICES: https://www.snapeda.com/parts/MAX17048G+T10/Analog+Devices/view-part/?ref=eda; DESCRIPTION: 3µA 1-Cell/2-Cell Fuel Gauge with ModelGauge; MF: Analog Devices; MP: MAX17048G+T10; PACKAGE: TDFN-8 Maxim; PRICE: None; PURCHASE-URL: https://www.snapeda.com/api/url_track_click_mouser/?unipart_id=329239&manufacturer=Analog Devices&part_name=MAX17048G+T10&search_term=None; SNAPEDA_LINK: https://www.snapeda.com/parts/MAX17048G+T10/Analog+Devices/view-part/?ref=snap
U$1 = InkTime_v5:NORDIC_NRF_4_NRF52840_QF: nRF52840 Features Advanced Single chip 2.4 GHz multi-protocol SoC 32-bit ARM Cortex-M4F Processor 1.7v to 5.5v operation 1MB flash + 256kB RAM Bluetooth 5 support for long range and high throughput 802.15.4 radio support On-chip NFC PPI –Programmable Peripheral Interconnect Automated power management system with automatic power management of each peripheral Configurable I/O mapping for analog and digital I/O 48 x GPIO 1 x QSPI 4 x Master/Slave SPI 2 x Two-wire interface (I²C) I²S interface 2 x UART 4 x PWM USB 2.0 controller ARM TrustZone CryptoCell-310 Cryptographic and security module AES 128-bit ECB/CCM/AAR hardware accelerator Digital microphone interface (PDM) Quadrature decoder 12-bit ADC Low power comparator On-chip 50Ω balun On-air compatible with nRF52, nRF51 and nRF24 Series Applications Advanced high performance wearables Wearables for secure payments Virtual Reality/Augmented Reality systems Smart Home sensor networks Smart city sensor networks High performance HID controllers Internet of Things (IoT) sensor networks Smart door locks Smart lighting networks Connected white goods
X1 = InkTime_v5:NORDIC_NRF_XTAL_32MHZ
X2 = InkTime_v5:NORDIC_NRF_1_XTAL_32KHZ